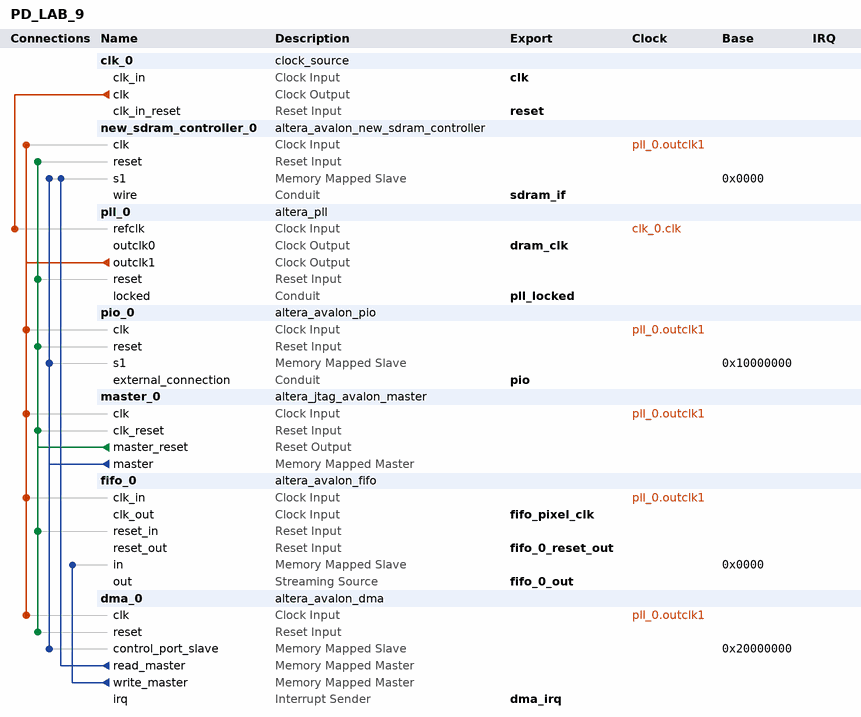
[diagram p0: system contents]
# Platform Designer (Qsys) system PD_LAB_9, Cyclone V 5CSXFC6D6F31C6
# Parameters at their usual value, and those the tool derives, are not listed.
package require -exact qsys 20.1
create_system PD_LAB_9
set_project_property DEVICE_FAMILY {Cyclone V}
set_project_property DEVICE 5CSXFC6D6F31C6

add_instance clk_0 clock_source 20.1
set_instance_parameter_value clk_0 clockFrequency 50000000

add_instance new_sdram_controller_0 altera_avalon_new_sdram_controller 20.1
set_instance_parameter_value new_sdram_controller_0 TAC 5.5
set_instance_parameter_value new_sdram_controller_0 TRCD 15.0
set_instance_parameter_value new_sdram_controller_0 TRFC 55.0
set_instance_parameter_value new_sdram_controller_0 TRP 15.0
set_instance_parameter_value new_sdram_controller_0 casLatency 2
set_instance_parameter_value new_sdram_controller_0 columnWidth 10
set_instance_parameter_value new_sdram_controller_0 dataWidth 16
set_instance_parameter_value new_sdram_controller_0 generateSimulationModel false
set_instance_parameter_value new_sdram_controller_0 initRefreshCommands 8
set_instance_parameter_value new_sdram_controller_0 model single_Micron_MT48LC4M32B2_7_chip
set_instance_parameter_value new_sdram_controller_0 numberOfBanks 4
set_instance_parameter_value new_sdram_controller_0 numberOfChipSelects 1
set_instance_parameter_value new_sdram_controller_0 powerUpDelay 100.0
set_instance_parameter_value new_sdram_controller_0 refreshPeriod 7.8
set_instance_parameter_value new_sdram_controller_0 rowWidth 13

add_instance pll_0 altera_pll 20.1
set_instance_parameter_value pll_0 gui_device_speed_grade 1
set_instance_parameter_value pll_0 gui_number_of_clocks 2
set_instance_parameter_value pll_0 gui_operation_mode direct
set_instance_parameter_value pll_0 gui_output_clock_frequency0 143.0
set_instance_parameter_value pll_0 gui_output_clock_frequency1 143.0
set_instance_parameter_value pll_0 gui_phase_shift0 -3000
set_instance_parameter_value pll_0 gui_pll_mode {Integer-N PLL}
set_instance_parameter_value pll_0 gui_reference_clock_frequency 50.0
set_instance_parameter_value pll_0 gui_use_locked true

add_instance pio_0 altera_avalon_pio 20.1
set_instance_parameter_value pio_0 direction Output
set_instance_parameter_value pio_0 width 1

add_instance master_0 altera_jtag_avalon_master 20.1

add_instance fifo_0 altera_avalon_fifo 20.1
set_instance_parameter_value fifo_0 bitsPerSymbol 32
set_instance_parameter_value fifo_0 channelWidth 0
set_instance_parameter_value fifo_0 errorWidth 0
set_instance_parameter_value fifo_0 fifoDepth 256
set_instance_parameter_value fifo_0 fifoInputInterfaceOptions AVALONMM_WRITE
set_instance_parameter_value fifo_0 fifoOutputInterfaceOptions AVALONST_SOURCE
set_instance_parameter_value fifo_0 singleClockMode false
set_instance_parameter_value fifo_0 symbolsPerBeat 1
set_instance_parameter_value fifo_0 useIRQ true
set_instance_parameter_value fifo_0 usePacket false
set_instance_parameter_value fifo_0 useReadControl false
set_instance_parameter_value fifo_0 useWriteControl false

add_instance dma_0 altera_avalon_dma 20.1
set_instance_parameter_value dma_0 allowByteTransactions true
set_instance_parameter_value dma_0 allowDoubleWordTransactions true
set_instance_parameter_value dma_0 allowHalfWordTransactions true
set_instance_parameter_value dma_0 allowQuadWordTransactions true
set_instance_parameter_value dma_0 burstEnable false
set_instance_parameter_value dma_0 fifoDepth 128
set_instance_parameter_value dma_0 maxBurstSize 128
set_instance_parameter_value dma_0 minimumDmaTransactionRegisterWidth 32

# connections
add_connection clk_0.clk pll_0.refclk clock
add_connection pll_0.outclk1 dma_0.clk clock
add_connection pll_0.outclk1 fifo_0.clk_in clock
add_connection pll_0.outclk1 master_0.clk clock
add_connection pll_0.outclk1 new_sdram_controller_0.clk clock
add_connection pll_0.outclk1 pio_0.clk clock
add_connection master_0.master_reset dma_0.reset reset
add_connection master_0.master_reset fifo_0.reset_in reset
add_connection master_0.master_reset master_0.clk_reset reset
add_connection master_0.master_reset new_sdram_controller_0.reset reset
add_connection master_0.master_reset pio_0.reset reset
add_connection master_0.master_reset pll_0.reset reset
add_connection dma_0.read_master new_sdram_controller_0.s1 avalon
set_connection_parameter_value dma_0.read_master/new_sdram_controller_0.s1 baseAddress 0x0000
add_connection dma_0.write_master fifo_0.in avalon
set_connection_parameter_value dma_0.write_master/fifo_0.in baseAddress 0x0000
add_connection master_0.master dma_0.control_port_slave avalon
set_connection_parameter_value master_0.master/dma_0.control_port_slave baseAddress 0x20000000
add_connection master_0.master new_sdram_controller_0.s1 avalon
set_connection_parameter_value master_0.master/new_sdram_controller_0.s1 baseAddress 0x0000
add_connection master_0.master pio_0.s1 avalon
set_connection_parameter_value master_0.master/pio_0.s1 baseAddress 0x10000000

# exported interfaces
add_interface clk clock sink
set_interface_property clk EXPORT_OF clk_0.clk_in
add_interface dma_irq interrupt sender
set_interface_property dma_irq EXPORT_OF dma_0.irq
add_interface dram_clk clock source
set_interface_property dram_clk EXPORT_OF pll_0.outclk0
add_interface fifo_0_out avalon_streaming source
set_interface_property fifo_0_out EXPORT_OF fifo_0.out
add_interface fifo_0_reset_out reset sink
set_interface_property fifo_0_reset_out EXPORT_OF fifo_0.reset_out
add_interface fifo_pixel_clk clock sink
set_interface_property fifo_pixel_clk EXPORT_OF fifo_0.clk_out
add_interface pio conduit end
set_interface_property pio EXPORT_OF pio_0.external_connection
add_interface pll_locked conduit end
set_interface_property pll_locked EXPORT_OF pll_0.locked
add_interface reset reset sink
set_interface_property reset EXPORT_OF clk_0.clk_in_reset
add_interface sdram_if conduit end
set_interface_property sdram_if EXPORT_OF new_sdram_controller_0.wire

set_interconnect_requirement {$system} qsys_mm.clockCrossingAdapter HANDSHAKE
set_interconnect_requirement {$system} qsys_mm.enableEccProtection FALSE
set_interconnect_requirement {$system} qsys_mm.insertDefaultSlave FALSE
set_interconnect_requirement {$system} qsys_mm.maxAdditionalLatency 1

save_system PD_LAB_9.qsys
